# EAGLE schematic ESP8266-07_SAMD21 (EAGLE 7.5.0)
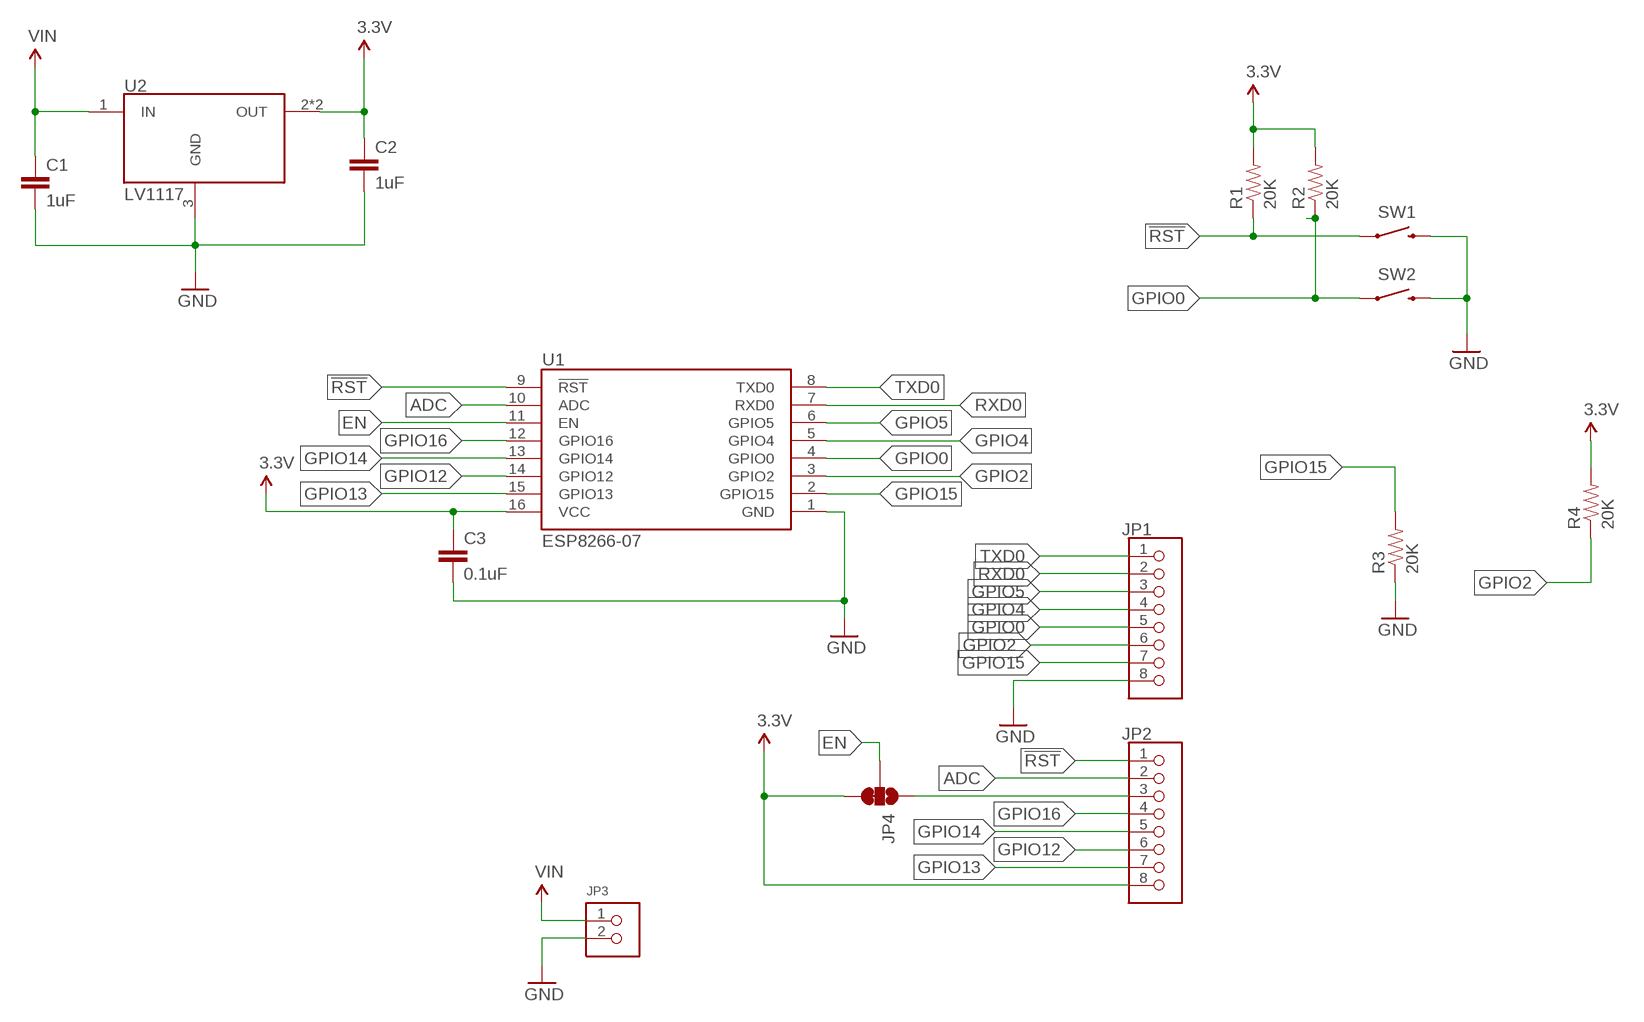
[diagram p0: schematic, sheet 1]

## Parts
C1  1uF  C0603  [C0603]
C2  1uF  C0603  [C0603]
C3  0.1uF  C0603  [C0603]
JP1  HEADER_1X8_100MIL_PTH  [HEADER_100MIL_1X8]
JP2  HEADER_1X8_100MIL_PTH  [HEADER_100MIL_1X8]
JP3  HEADER_1X2_100MIL  [HEADER_100MIL_1X2]
JP4  JUMPER-PAD-3-2OF3_NC_BY_TRACE  [PAD-JUMPER-3-2OF3_NC_BY_TRACE_YES_SILK_FULL_BOX]
R1  20K  R0603  [R0603]
R2  20K  R0603  [R0603]
R3  20K  R0603  [R0603]
R4  20K  R0603  [R0603]
SW1  KMR221GLFS  [TACTILE_SWITCH_SMD-3]
SW2  KMR221GLFS  [TACTILE_SWITCH_SMD-3]
U1  ESP8266-07  [ESP8266-07]
U2  TLV1114DCY  [SOT223]

## Nets
3.3V: C2.1 C3.1 JP2.8 JP4.3 R1.2 R2.2 R4.2 U1.16(VCC) U2.2(OUT) U2.TAB(OUT)
!RST: JP2.1 R1.1 SW1.1 SW1.2 U1.9(!RST)
ADC: JP2.2 U1.10(ADC)
EN: JP4.2 U1.11(EN)
GND: C1.2 C2.2 C3.2 JP1.8 JP3.2 R3.1 SW1.3 SW1.4 SW2.3 SW2.4 U1.1(GND) U2.3(GND)
GPIO0: JP1.5 R2.1 SW2.1 SW2.2 U1.4(GPIO0)
GPIO2: JP1.6 R4.1 U1.3(GPIO2)
GPIO4: JP1.4 U1.5(GPIO4)
GPIO5: JP1.3 U1.6(GPIO5)
GPIO12: JP2.6 U1.14(GPIO12)
GPIO13: JP2.7 U1.15(GPIO13)
GPIO14: JP2.5 U1.13(GPIO14)
GPIO15: JP1.7 R3.2 U1.2(GPIO15)
GPIO16: JP2.4 U1.12(GPIO16)
N$11: JP2.3 JP4.1
RXD0: JP1.2 U1.7(RXD0)
TXD0: JP1.1 U1.8(TXD0)
VIN: C1.1 JP3.1 U2.1(IN)

## Library data of the parts
C1-C3 = heck:C
JP1 JP2 = heck:HEADER_1X8
JP3 = heck:HEADER_1X2
JP4 = heck:JUMPER-PAD-3-2OF3_NC_BY_TRACE
R1-R4 = heck:R
SW1 SW2 = heck:KMR221
U1 = heck:ESP8266-07
U2 = heck:TLV1114